# EAGLE design BuckpuckBreakoutv2 (EAGLE 5.11)
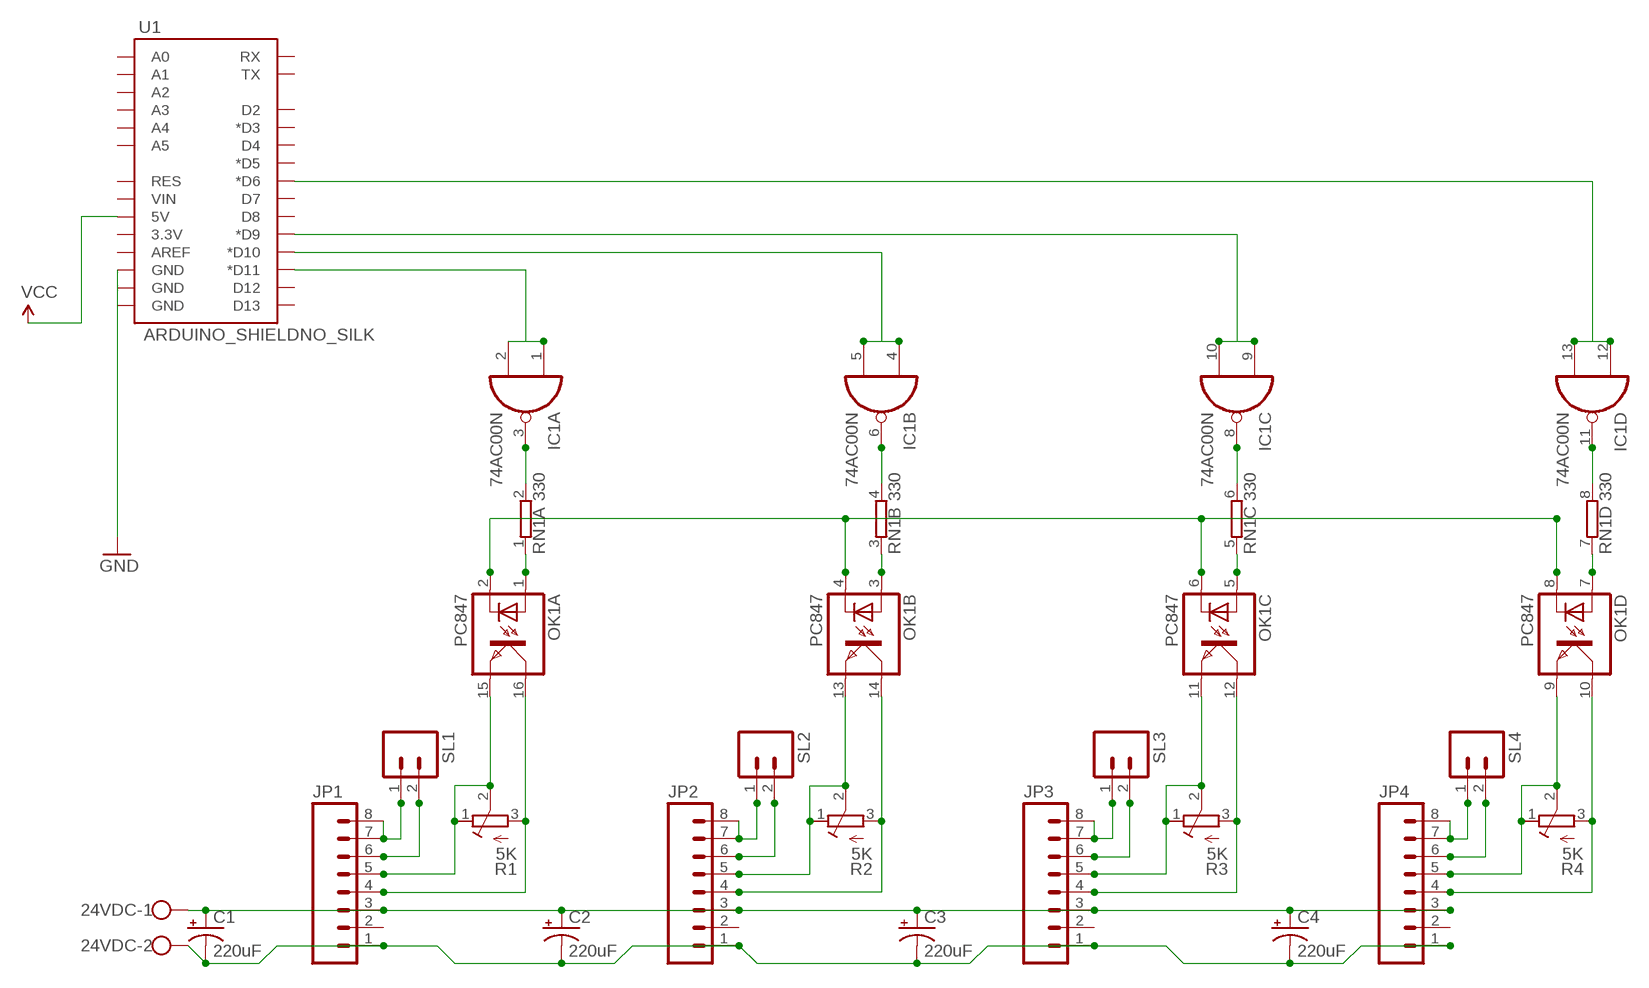
[diagram p0: schematic, sheet 1]

## Parts
24VDC  W237-102  [W237-102]
C1  220uF  CAP_POLPTH3  [CPOL-RADIAL-1000UF-63V]
C2  220uF  CAP_POLPTH3  [CPOL-RADIAL-1000UF-63V]
C3  220uF  CAP_POLPTH3  [CPOL-RADIAL-1000UF-63V]
C4  220uF  CAP_POLPTH3  [CPOL-RADIAL-1000UF-63V]
IC1  74AC00N  [DIL14]
JP1  M08  [1X08]
JP2  M08  [1X08]
JP3  M08  [1X08]
JP4  M08  [1X08]
OK1  PC847  [DIL16]
R1  5K  R-TRIMMT93YB  [RTRIMT93YB]
R2  5K  R-TRIMMT93YB  [RTRIMT93YB]
R3  5K  R-TRIMMT93YB  [RTRIMT93YB]
R4  5K  R-TRIMMT93YB  [RTRIMT93YB]
RN1  330  E4R  [SIL8]
SL1  M02  [02P]
SL2  M02  [02P]
SL3  M02  [02P]
SL4  M02  [02P]
U1  ARDUINO_SHIELDNO_SILK  [DUEMILANOVE_VIAS]

## Nets
24V: 24VDC.1 C1.1(+) C2.1(+) C3.1(+) C4.1(+) JP1.3 JP2.3 JP3.3 JP4.3
GND: U1.GND@0(GND) U1.GND@1(GND) U1.GND@2(GND)
LED+_1: JP1.7 JP1.8 SL1.1
LED+_2: JP2.7 JP2.8 SL2.1
LED+_3: JP3.7 JP3.8 SL3.1
LED+_4: JP4.7 JP4.8 SL4.1
LED-_1: JP1.6 SL1.2
LED-_2: JP2.6 SL2.2
LED-_3: JP3.6 SL3.2
LED-_4: JP4.6 SL4.2
N$1: OK1.1(A:A) RN1.1
N$2: IC1.3(A:O) RN1.2
N$3: IC1.6(B:O) RN1.4
N$4: IC1.1(A:I0) IC1.2(A:I1) U1.D11(*D11)
N$5: IC1.4(B:I0) IC1.5(B:I1) U1.D10(*D10)
N$6: IC1.9(C:I0) IC1.10(C:I1) U1.D9(*D9)
N$7: IC1.12(D:I0) IC1.13(D:I1) U1.D6(*D6)
N$8: IC1.11(D:O) RN1.8
N$9: OK1.7(D:A) RN1.7
N$10: IC1.8(C:O) RN1.6
N$11: OK1.5(C:A) RN1.5
N$12: OK1.3(B:A) RN1.3
N$13: JP2.4 OK1.14(B:COL) R2.3(E)
N$14: JP1.4 OK1.16(A:COL) R1.3(E)
N$15: JP1.5 OK1.15(A:EMIT) R1.1(A) R1.2(S)
N$16: JP2.5 OK1.13(B:EMIT) R2.1(A) R2.2(S)
N$17: JP3.5 OK1.11(C:EMIT) R3.1(A) R3.2(S)
N$18: JP3.4 OK1.12(C:COL) R3.3(E)
N$19: JP4.4 OK1.10(D:COL) R4.3(E)
N$20: JP4.5 OK1.9(D:EMIT) R4.1(A) R4.2(S)
N$21: OK1.2(A:C) OK1.4(B:C) OK1.6(C:C) OK1.8(D:C)
N$26: 24VDC.2 C1.2(-) C2.2(-) C3.2(-) C4.2(-) JP1.1 JP2.1 JP3.1 JP4.1
VCC: U1.5V
Unconnected: JP1.2 JP2.2 JP3.2 JP4.2 U1.3.3V U1.A0 U1.A1 U1.A2 U1.A3 U1.A4 U1.A5 U1.AREF U1.D2 U1.D3(*D3) U1.D4 U1.D5(*D5) U1.D7 U1.D8 U1.D12 U1.D13 U1.RES U1.RX U1.TX U1.VIN

## Power pins joined to a net without a drawn wire
GND: IC1.7(P:GND)
VCC: IC1.14(P:VCC)

## Library data of the parts
24VDC = con-wago-500:W237-102: WAGO SCREW CLAMP
C1-C4 = SparkFun:CAP_POL: Capacitor Polarized These are standard SMD and PTH capacitors. Normally 10uF, 47uF, and 100uF in electrolytic and tantalum varieties. Always verify the external diameter of the through hole cap, it varies with capacity, voltage, and manufacturer. The EIA devices should be standard.
IC1 = 74xx-eu:74*00: Quad 2-input NAND gate
JP1-JP4 = SparkFun:M08: Header 8 Standard 8-pin 0.1" header. Use with straight break away headers (SKU : PRT-00116), right angle break away headers (PRT-00553), swiss pins (PRT-00743), machine pins (PRT-00117), and female headers (PRT-00115).
OK1 = optocoupler:PC847: SHARP OPTO COUPLER; OC_FARNELL: 9707735; OC_NEWARK: unknown
R1-R4 = resistor:R-TRIMM: Trimm resistor
RN1 = resistor-sil:E4R: SIL RESISTOR; OC_FARNELL: unknown; OC_NEWARK: unknown
SL1-SL4 = con-amp-quick:M02: AMP QUICK CONNECTOR
U1 = SparkFun:ARDUINO_SHIELD

## Board
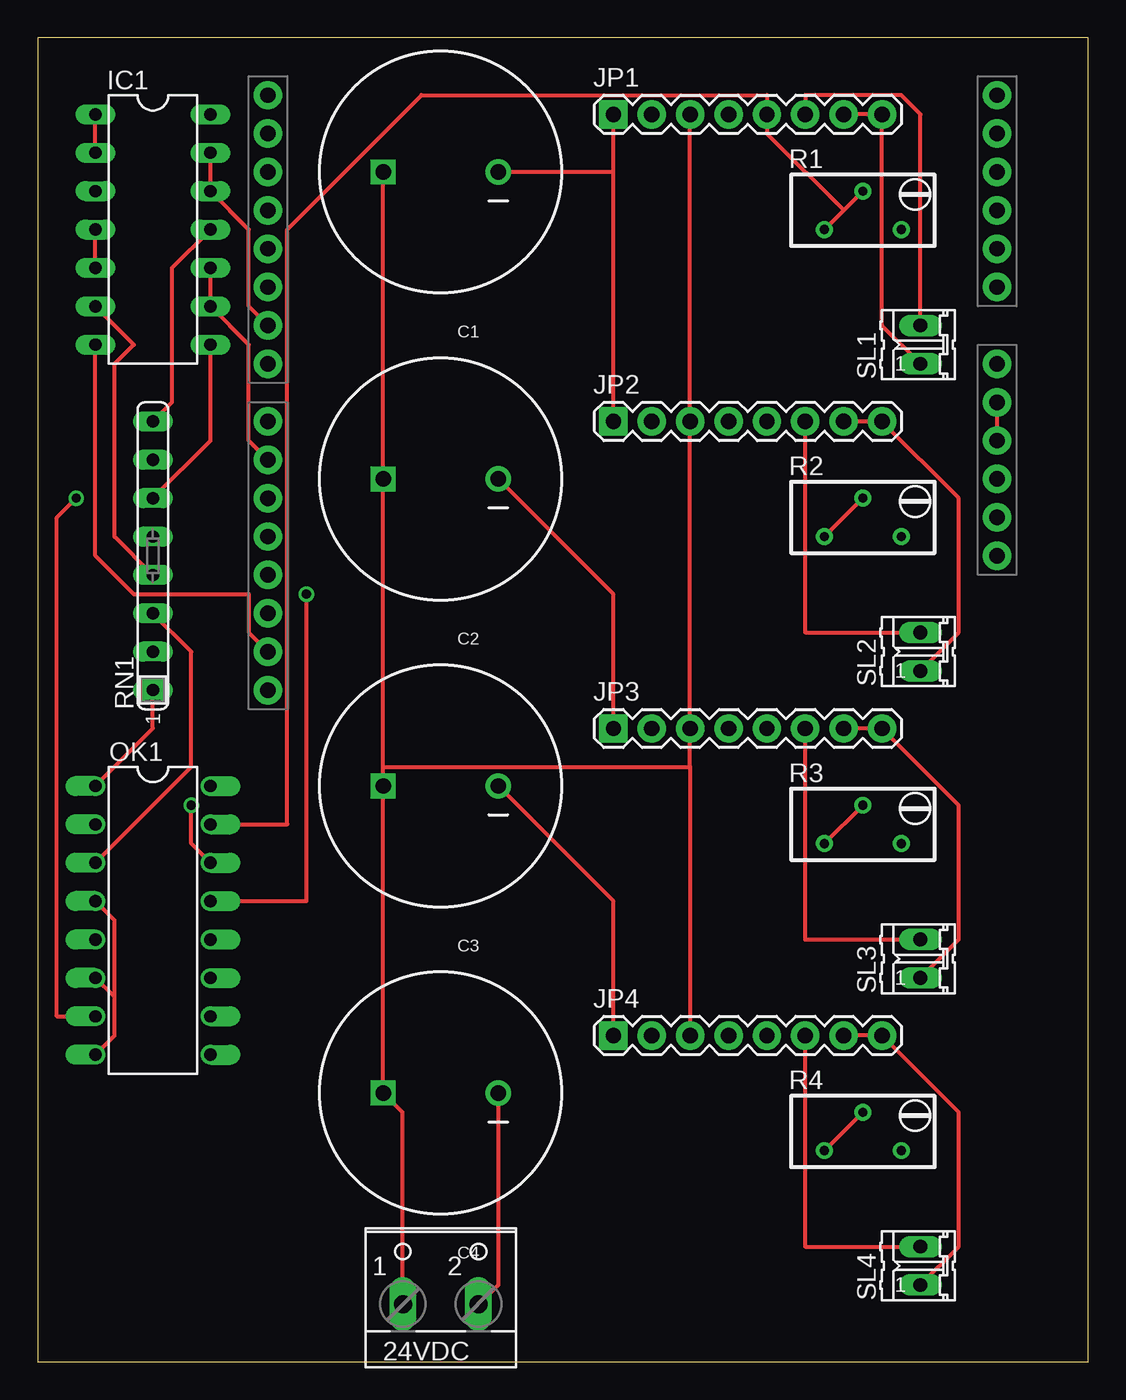
[diagram p1: board, top side]
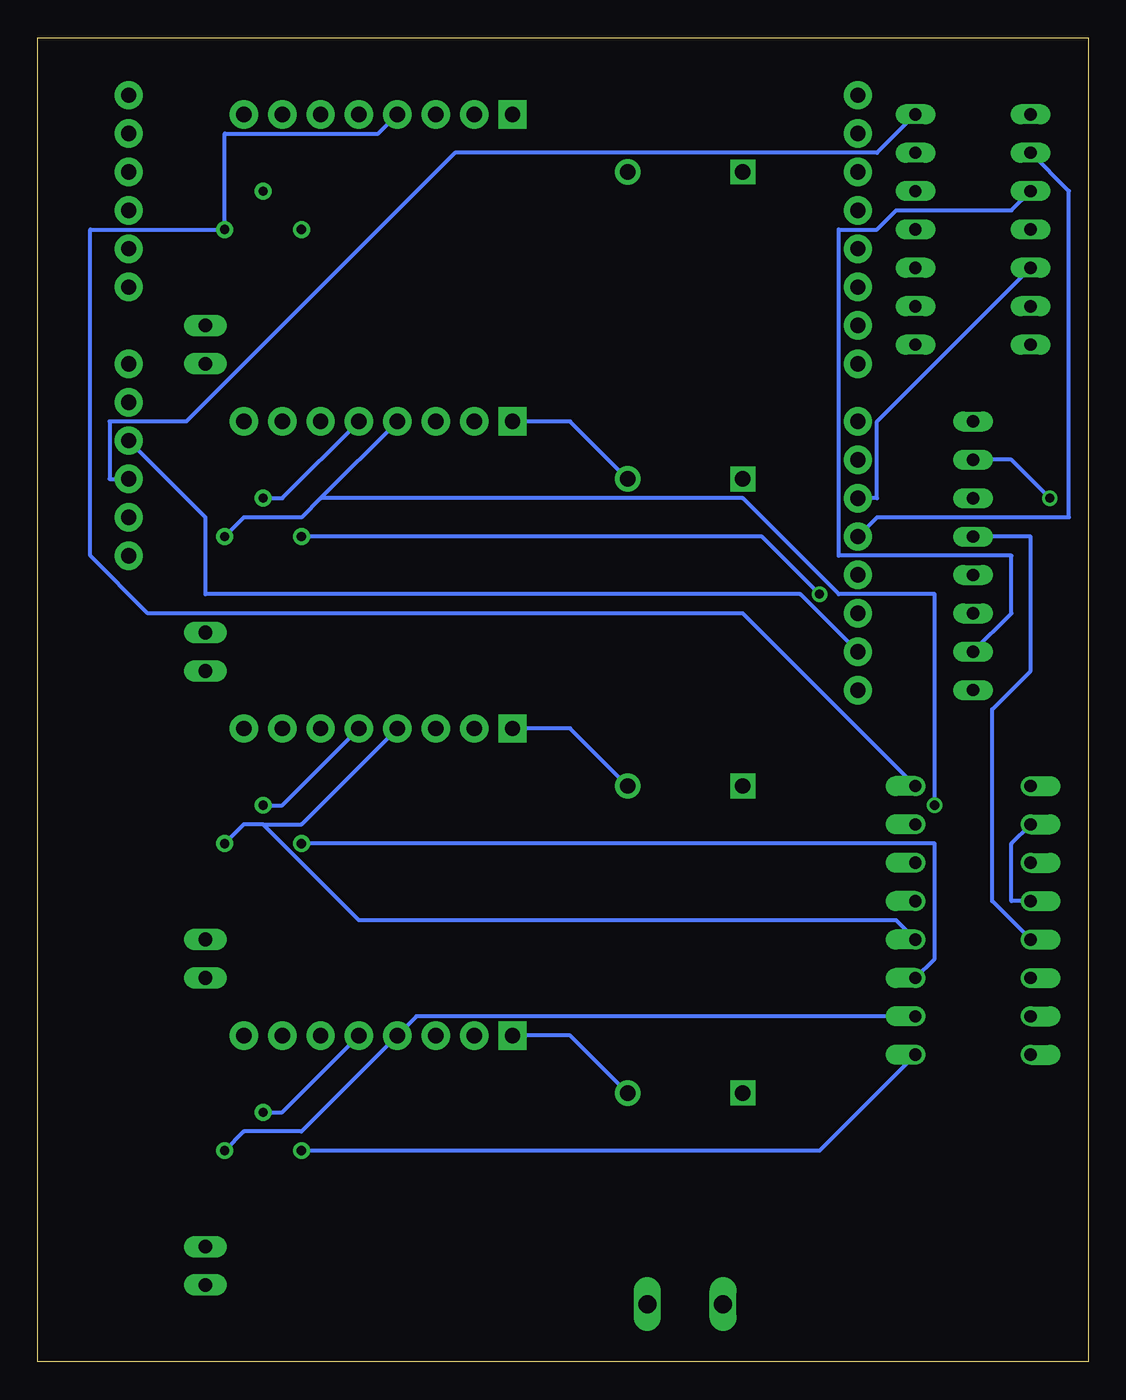
[diagram p2: board, bottom side, seen from below]

Size 69.52 x 87.62 mm. Coordinates in mm from the lower left corner, seen from the top.
Outline: 0,0 69.52,0 69.52,87.62 0,87.62 0,0
Copper layers (1*16): Top 0.035mm / dielectric 1.5mm / Bottom 0.035mm
Design rules "default": minimum track width 10mil, minimum drill 24mil, track to track 8mil, track to pad 8mil, pad to pad 8mil, via to via 8mil, smd to smd 8mil, copper to edge 40mil, drill to drill 8mil, minimum pad ring 10mil, minimum via ring 8mil, stop-mask expansion 4mil, vias tented up to drill 0mil, thermal gap 10mil

### Footprints (pad centres in the part's own frame; a part is rotated, then mirrored left to right if it is on the bottom)
W237-102 = drill 1.194 long: 1 -2.5,-1.27; 2 2.5,-1.27
CPOL-RADIAL-1000UF-63V = drill 1.016 pad 1.651 square: 1 3.81,0 | drill 1.016 pad 1.676 round: 2 -3.81,0
DIL14 = drill 0.813 long: 1 -7.62,-3.81; 2 -5.08,-3.81; 3 -2.54,-3.81; 4 0,-3.81; 5 2.54,-3.81; 6 5.08,-3.81; 7 7.62,-3.81; 8 7.62,3.81; 9 5.08,3.81; 10 2.54,3.81; 11 0,3.81; 12 -2.54,3.81; 13 -5.08,3.81; 14 -7.62,3.81
1X08 = drill 1.016 pad 1.88 square: 1 0,0 | drill 1.016 pad 1.88 round: 2 2.54,0; 3 5.08,0; 4 7.62,0; 5 10.16,0; 6 12.7,0; 7 15.24,0; 8 17.78,0
DIL16 = drill 0.813 offset: 1 -8.89,-3.81; 2 -6.35,-3.81; 3 -3.81,-3.81; 4 -1.27,-3.81; 5 1.27,-3.81; 6 3.81,-3.81; 7 6.35,-3.81; 8 8.89,-3.81; 9 8.89,3.81; 10 6.35,3.81; 11 3.81,3.81; 12 1.27,3.81; 13 -1.27,3.81; 14 -3.81,3.81; 15 -6.35,3.81; 16 -8.89,3.81
RTRIMT93YB = drill 0.61 round: 1 1.27,-2.54; 2 -1.27,0; 3 1.27,2.54
SIL8 = drill 0.813 long: 1 -8.89,0; 2 -6.35,0; 3 -3.81,0; 4 -1.27,0; 5 1.27,0; 6 3.81,0; 7 6.35,0; 8 8.89,0
02P = drill 0.914 long: 1 -1.27,0; 2 1.27,0
DUEMILANOVE_VIAS = drill 1.016 pad 1.88 round: 3.3V 50.8,13.97; 5V 50.8,16.51; A0 50.8,29.21; A1 50.8,31.75; A2 50.8,34.29; A3 50.8,36.83; A4 50.8,39.37; A5 50.8,41.91; AREF 2.54,2.54; D2 2.54,36.83; D3 2.54,34.29; D4 2.54,31.75; D5 2.54,29.21; D6 2.54,26.67; D7 2.54,24.13; D8 2.54,20.32; D9 2.54,17.78; D10 2.54,15.24; D11 2.54,12.7; D12 2.54,10.16; D13 2.54,7.62; GND@0 50.8,19.05; GND@1 50.8,21.59; GND@2 2.54,5.08; RES 50.8,11.43; RX 2.54,41.91; TX 2.54,39.37; VIN 50.8,24.13

### Placement (x,y rotation side)
24VDC  26.67,5.08 0 top
C1  26.67,78.74 180 top
C2  26.67,58.42 180 top
C3  26.67,38.1 180 top
C4  26.67,17.78 180 top
IC1  7.62,74.93 270 top
JP1  38.1,82.55 0 top
JP2  38.1,62.23 0 top
JP3  38.1,41.91 0 top
JP4  38.1,21.59 0 top
OK1  7.62,29.21 270 top
R1  54.61,76.2 270 top
R2  54.61,55.88 270 top
R3  54.61,35.56 270 top
R4  54.61,15.24 270 top
RN1  7.62,53.34 90 top
SL1  58.42,67.31 90 top
SL2  58.42,46.99 90 top
SL3  58.42,26.67 90 top
SL4  58.42,6.35 90 top
U1  12.7,41.91 0 top

### Tracks (layer width: path | path; a pad name or v marks a point on that pad's centre or on a via)
24V
  Top 0.254: 43.18,39.37 JP3.3 JP2.3 JP1.3 | 43.18,39.37 JP4.3 | 24VDC.1 24.13,3.81 24.13,16.51 C4.1 C3.1 22.86,39.37 | 22.86,39.37 C2.1 C1.1 | 22.86,39.37 43.18,39.37
GND
  Top 0.254: U1.GND@0 U1.GND@1 | IC1.7 3.81,53.34 6.35,50.8 13.97,50.8 13.97,48.26 U1.GND@2
  Bottom 0.254: U1.GND@0 58.42,55.88 58.42,50.8 19.05,50.8 U1.GND@2
LED+_1
  Top 0.254: SL1.1 55.88,68.58 JP1.8 JP1.7
LED+_2
  Top 0.254: SL2.1 60.96,48.26 60.96,57.15 JP2.8 JP2.7
LED+_3
  Top 0.254: SL3.1 60.96,27.94 60.96,36.83 JP3.8 JP3.7
LED+_4
  Top 0.254: SL4.1 60.96,7.62 60.96,16.51 JP4.8 JP4.7
LED-_1
  Top 0.254: SL1.2 58.42,82.55 57.15,83.82 50.8,83.82 JP1.6
LED-_2
  Top 0.254: SL2.2 50.8,48.26 JP2.6
LED-_3
  Top 0.254: SL3.2 50.8,27.94 JP3.6
LED-_4
  Top 0.254: SL4.2 50.8,7.62 JP4.6
N$1
  Top 0.254: OK1.1 7.62,41.91 RN1.1
N$2
  Bottom 0.254: RN1.2 5.08,49.53 5.08,53.34 16.51,53.34 16.51,74.93 13.97,74.93 12.7,76.2 5.08,76.2 IC1.3
N$3
  Top 0.254: RN1.4 5.08,54.61 5.08,66.04 6.35,67.31 IC1.6
N$4
  Top 0.254: IC1.2 IC1.1
  Bottom 0.254: IC1.2 1.27,77.47 1.27,55.88 13.97,55.88 U1.D11
N$5
  Top 0.254: IC1.5 IC1.4
  Bottom 0.254: IC1.5 13.97,62.23 13.97,57.15 U1.D10
N$6
  Top 0.254: IC1.10 IC1.9 13.97,67.31 13.97,60.96 U1.D9
N$7
  Top 0.254: IC1.13 IC1.12 13.97,74.93 13.97,69.85 U1.D6
N$8
  Top 0.254: RN1.8 8.89,63.5 8.89,72.39 IC1.11
N$9  (via drill 0.61)
  Top 0.254: OK1.7 1.27,22.86 1.27,55.88 v2.54,57.15
  Bottom 0.254: v2.54,57.15 5.08,59.69 RN1.7
N$10
  Top 0.254: RN1.6 11.43,60.96 IC1.8
N$11
  Bottom 0.254: OK1.5 6.35,30.48 6.35,43.18 3.81,45.72 3.81,54.61 RN1.5
N$12
  Top 0.254: OK1.3 10.16,39.37 10.16,46.99 RN1.3
N$13  (via drill 0.61)
  Top 0.254: OK1.14 10.16,34.29 v10.16,36.83
  Bottom 0.254: R2.3 55.88,55.88 52.07,55.88 50.8,57.15 | 50.8,57.15 JP2.4 | v10.16,36.83 10.16,50.8 16.51,50.8 22.86,57.15 50.8,57.15
N$14
  Bottom 0.254: JP1.4 46.99,81.28 57.15,81.28 R1.3 66.04,74.93 66.04,53.34 62.23,49.53 22.86,49.53 OK1.16
N$15
  Top 0.254: 53.34,76.2 R1.2 | 53.34,76.2 R1.1 | OK1.15 16.51,35.56 16.51,74.93 25.4,83.82 48.26,83.82 JP1.5 48.26,81.28 53.34,76.2
N$16  (via drill 0.61)
  Top 0.254: R2.1 R2.2 | OK1.13 17.78,30.48 v17.78,50.8
  Bottom 0.254: v17.78,50.8 21.59,54.61 R2.1 | JP2.5 53.34,57.15 R2.2
N$17
  Top 0.254: R3.1 R3.2
  Bottom 0.254: OK1.11 10.16,26.67 10.16,34.29 R3.1 | JP3.5 53.34,36.83 R3.2
N$18
  Bottom 0.254: R3.3 55.88,35.56 54.61,35.56 | 54.61,35.56 52.07,35.56 JP3.4 | OK1.12 12.7,29.21 48.26,29.21 54.61,35.56
N$19
  Bottom 0.254: R4.3 55.88,15.24 52.07,15.24 JP4.4 44.45,22.86 OK1.10
N$20
  Top 0.254: R4.1 R4.2
  Bottom 0.254: OK1.9 17.78,13.97 R4.1 | JP4.5 53.34,16.51 R4.2
N$21
  Top 0.254: OK1.8 5.08,21.59 5.08,24.13 | 5.08,24.13 OK1.6 | OK1.4 5.08,29.21 5.08,24.13
  Bottom 0.254: OK1.2 5.08,34.29 5.08,30.48 OK1.4
N$26
  Top 0.254: 38.1,78.74 C1.2 | 38.1,78.74 JP1.1 | JP2.1 38.1,78.74 | C4.2 30.48,5.08 29.21,3.81 24VDC.2 | C3.2 38.1,30.48 JP4.1 | C2.2 38.1,50.8 JP3.1
  Bottom 0.254: C2.2 34.29,62.23 JP2.1 | C3.2 34.29,41.91 JP3.1 | C4.2 34.29,21.59 JP4.1
VCC
  Bottom 0.254: IC1.14 13.97,80.01 41.91,80.01 59.69,62.23 64.77,62.23 64.77,58.42 U1.5V